# EAGLE design uo_C_SE_Main_Board (EAGLE 9.5.2)

## Sheet 1 of 3
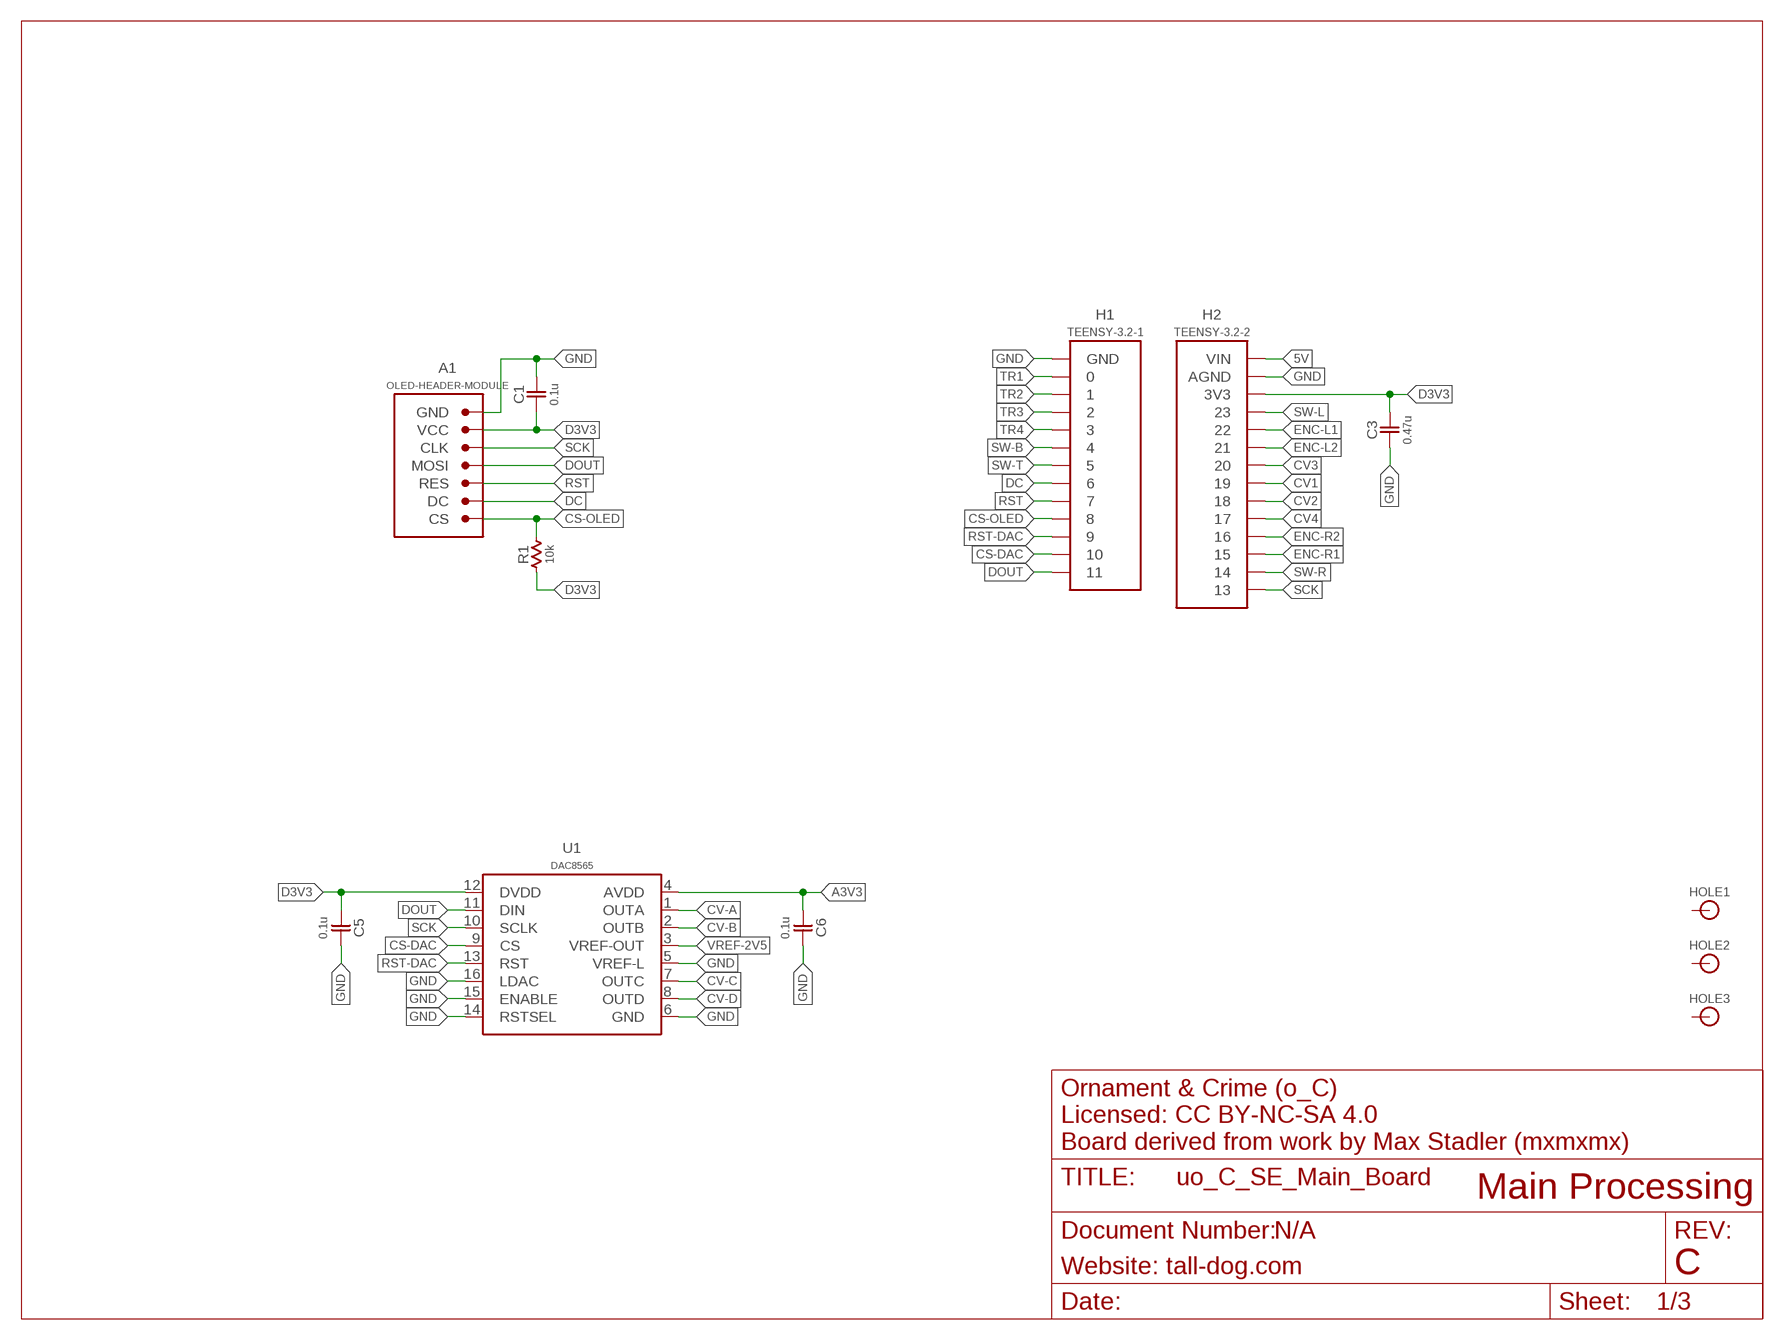
[diagram p0: schematic, sheet 1]

### Parts
A1  OLED-HEADER-MODULE  [DISPLAY-MODULE]
C1  0.1u  CAP-NP-0603  [0603-NP]
C3  0.47u  CAP-NP-0603  [0603-NP]
C5  0.1u  CAP-NP-0603  [0603-NP]
C6  0.1u  CAP-NP-0603  [0603-NP]
H1  TEENSY-3.2-1  [SMD-0.1-1X13]
H2  TEENSY-3.2-2  [SMD-0.1-1X14]
HOLE1  HOLE  [M2.5-HOLE]
HOLE2  HOLE  [M2.5-HOLE]
HOLE3  HOLE  [M2.5-HOLE]
R1  10k  RESISTOR-0603  [0603-NP]
U1  DAC8565  [TSSOP-16]

### Nets
5V: H2.1(VIN) ; also sheet 3
A3V3: C6.1 U1.4(AVDD) ; also sheet 2,3
CS-DAC: H1.12 U1.9(CS)
CS-OLED: A1.7(CS) H1.10 R1.2
CV1: H2.8 ; also sheet 2
CV2: H2.9 ; also sheet 2
CV3: H2.7 ; also sheet 2
CV4: H2.10 ; also sheet 2
CV-A: U1.1(OUTA) ; also sheet 2
CV-B: U1.2(OUTB) ; also sheet 2
CV-C: U1.7(OUTC) ; also sheet 2
CV-D: U1.8(OUTD) ; also sheet 2
D3V3: A1.2(VCC) C1.1 C3.2 C5.1 H2.3(3V3) R1.1 U1.12(DVDD)
DC: A1.6(DC) H1.8
DOUT: A1.4(MOSI) H1.13 U1.11(DIN)
ENC-L1: H2.5 ; also sheet 3
ENC-L2: H2.6 ; also sheet 3
ENC-R1: H2.12 ; also sheet 3
ENC-R2: H2.11 ; also sheet 3
GND: A1.1(GND) A1.G1(GND) A1.G2(GND) A1.G3(GND) A1.G4(GND) A1.G5(GND) A1.G6(GND) C1.2 C3.1 C5.2 C6.2 H1.1(GND) H2.2(AGND) U1.5(VREF-L) U1.6(GND) U1.14(RSTSEL) U1.15(ENABLE) U1.16(LDAC) ; also sheet 2,3
RST: A1.5(RES) H1.9
RST-DAC: H1.11 U1.13(RST)
SCK: A1.3(CLK) H2.14 U1.10(SCLK)
SW-B: H1.6 ; also sheet 3
SW-L: H2.4 ; also sheet 3
SW-R: H2.13 ; also sheet 3
SW-T: H1.7 ; also sheet 3
TR1: H1.2 ; also sheet 2
TR2: H1.3 ; also sheet 2
TR3: H1.4 ; also sheet 2
TR4: H1.5 ; also sheet 2
VREF-2V5: U1.3(VREF-OUT) ; also sheet 3
Unconnected: HOLE1.P$1 HOLE1.P$2 HOLE1.P$3 HOLE1.P$4 HOLE1.P$5 HOLE1.P$6 HOLE1.P$7 HOLE1.P$8 HOLE1.P$9 HOLE2.P$1 HOLE2.P$2 HOLE2.P$3 HOLE2.P$4 HOLE2.P$5 HOLE2.P$6 HOLE2.P$7 HOLE2.P$8 HOLE2.P$9 HOLE3.P$1 HOLE3.P$2 HOLE3.P$3 HOLE3.P$4 HOLE3.P$5 HOLE3.P$6 HOLE3.P$7 HOLE3.P$8 HOLE3.P$9

### Notes on the sheet
- Ornament & Crime (o_C)
  Licensed: CC BY-NC-SA 4.0
  Board derived from work by Max Stadler (mxmxmx)
- Main Processing
- N/A
- Website: tall-dog.com | C

## Sheet 2 of 3
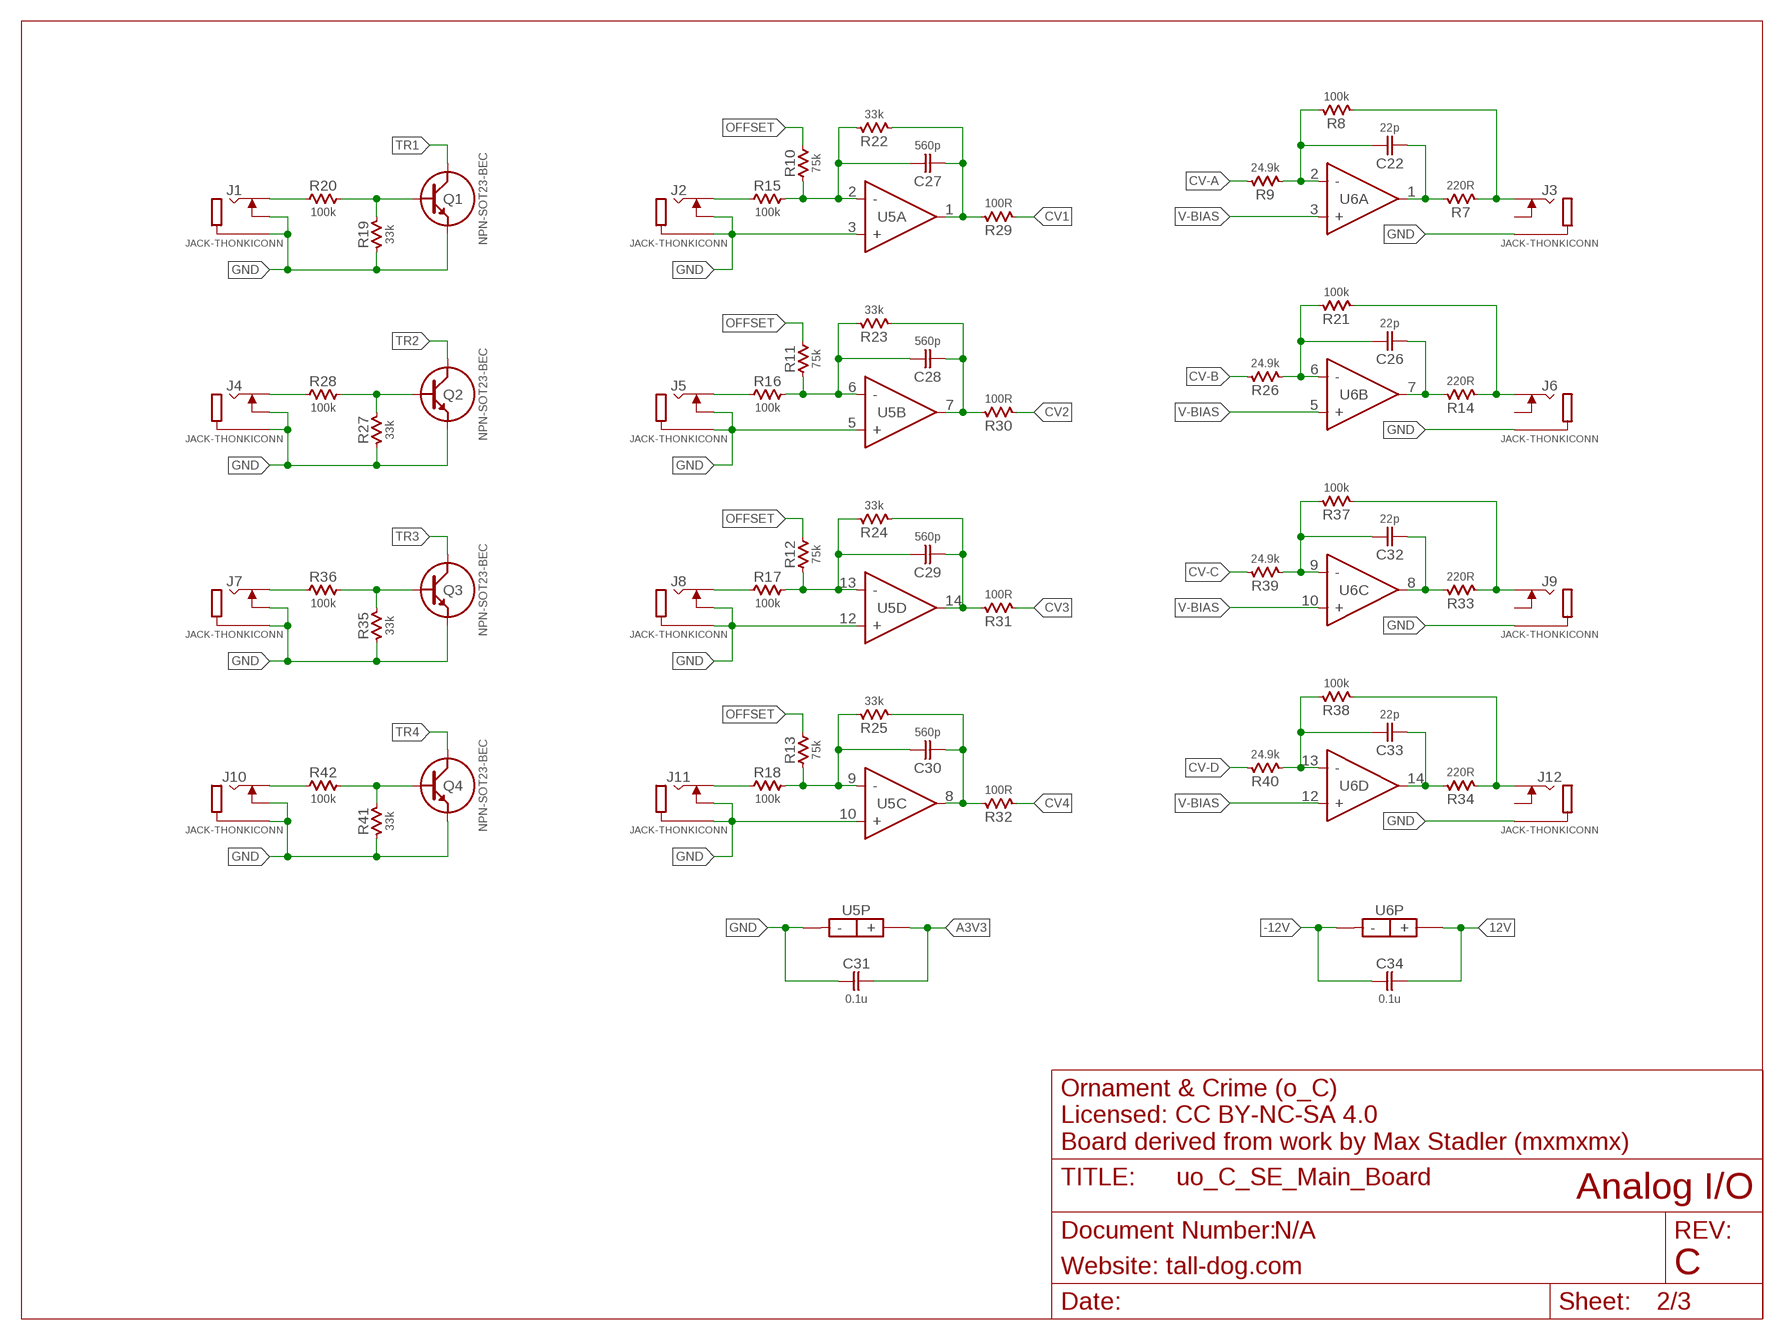
[diagram p1: schematic, sheet 2]

### Parts
C22  22p  CAP-NP-0603  [0603-NP]
C26  22p  CAP-NP-0603  [0603-NP]
C27  560p  CAP-NP-0603  [0603-NP]
C28  560p  CAP-NP-0603  [0603-NP]
C29  560p  CAP-NP-0603  [0603-NP]
C30  560p  CAP-NP-0603  [0603-NP]
C31  0.1u  CAP-NP-0603  [0603-NP]
C32  22p  CAP-NP-0603  [0603-NP]
C33  22p  CAP-NP-0603  [0603-NP]
C34  0.1u  CAP-NP-0603  [0603-NP]
J1  JACK-THONKICONN  [JACK]
J2  JACK-THONKICONN  [JACK]
J3  JACK-THONKICONN  [JACK]
J4  JACK-THONKICONN  [JACK]
J5  JACK-THONKICONN  [JACK]
J6  JACK-THONKICONN  [JACK]
J7  JACK-THONKICONN  [JACK]
J8  JACK-THONKICONN  [JACK]
J9  JACK-THONKICONN  [JACK]
J10  JACK-THONKICONN  [JACK]
J11  JACK-THONKICONN  [JACK]
J12  JACK-THONKICONN  [JACK]
Q1  NPN-SOT23-BEC  [SOT-23-3]
Q2  NPN-SOT23-BEC  [SOT-23-3]
Q3  NPN-SOT23-BEC  [SOT-23-3]
Q4  NPN-SOT23-BEC  [SOT-23-3]
R7  220R  RESISTOR-0603  [0603-NP]
R8  100k  RESISTOR-0603  [0603-NP]
R9  24.9k  RESISTOR-0603  [0603-NP]
R10  75k  RESISTOR-0603  [0603-NP]
R11  75k  RESISTOR-0603  [0603-NP]
R12  75k  RESISTOR-0603  [0603-NP]
R13  75k  RESISTOR-0603  [0603-NP]
R14  220R  RESISTOR-0603  [0603-NP]
R15  100k  RESISTOR-0603  [0603-NP]
R16  100k  RESISTOR-0603  [0603-NP]
R17  100k  RESISTOR-0603  [0603-NP]
R18  100k  RESISTOR-0603  [0603-NP]
R19  33k  RESISTOR-0603  [0603-NP]
R20  100k  RESISTOR-0603  [0603-NP]
R21  100k  RESISTOR-0603  [0603-NP]
R22  33k  RESISTOR-0603  [0603-NP]
R23  33k  RESISTOR-0603  [0603-NP]
R24  33k  RESISTOR-0603  [0603-NP]
R25  33k  RESISTOR-0603  [0603-NP]
R26  24.9k  RESISTOR-0603  [0603-NP]
R27  33k  RESISTOR-0603  [0603-NP]
R28  100k  RESISTOR-0603  [0603-NP]
R29  100R  RESISTOR-0603  [0603-NP]
R30  100R  RESISTOR-0603  [0603-NP]
R31  100R  RESISTOR-0603  [0603-NP]
R32  100R  RESISTOR-0603  [0603-NP]
R33  220R  RESISTOR-0603  [0603-NP]
R34  220R  RESISTOR-0603  [0603-NP]
R35  33k  RESISTOR-0603  [0603-NP]
R36  100k  RESISTOR-0603  [0603-NP]
R37  100k  RESISTOR-0603  [0603-NP]
R38  100k  RESISTOR-0603  [0603-NP]
R39  24.9k  RESISTOR-0603  [0603-NP]
R40  24.9k  RESISTOR-0603  [0603-NP]
R41  33k  RESISTOR-0603  [0603-NP]
R42  100k  RESISTOR-0603  [0603-NP]
U5  MCP6004-TSSOP-14  [TSSOP-14]
U6  OPA4172  [TSSOP-14]

### Nets
12V: C34.1 U6.4(P:+) ; also sheet 3
-12V: C34.2 U6.11(P:-) ; also sheet 3
A3V3: C31.1 U5.4(P:+) ; also sheet 1,3
CV1: R29.2 ; also sheet 1
CV2: R30.2 ; also sheet 1
CV3: R31.2 ; also sheet 1
CV4: R32.2 ; also sheet 1
CV-A: R9.1 ; also sheet 1
CV-B: R26.1 ; also sheet 1
CV-C: R39.1 ; also sheet 1
CV-D: R40.1 ; also sheet 1
GND: C31.2 J1.P1 J1.P2 J2.P1 J2.P2 J3.P1 J4.P1 J4.P2 J5.P1 J5.P2 J6.P1 J7.P1 J7.P2 J8.P1 J8.P2 J9.P1 J10.P1 J10.P2 J11.P1 J11.P2 J12.P1 Q1.2(E) Q2.2(E) Q3.2(E) Q4.2(E) R19.2 R27.2 R35.2 R41.2 U5.3(A:+) U5.5(B:+) U5.10(C:+) U5.11(P:-) U5.12(D:+) ; also sheet 1,3
N$8: J11.P3 R18.1
N$10: J8.P3 R17.1
N$11: J5.P3 R16.1
N$12: J2.P3 R15.1
N$13: J1.P3 R20.1
N$14: C27.1 R10.1 R15.2 R22.1 U5.2(A:-)
N$15: Q1.1(B) R19.1 R20.2
N$16: C28.1 R11.1 R16.2 R23.1 U5.6(B:-)
N$18: C29.1 R12.1 R17.2 R24.1 U5.13(D:-)
N$19: C22.2 R8.1 R9.2 U6.2(A:-)
N$20: C30.1 R13.1 R18.2 R25.1 U5.9(C:-)
N$21: J4.P3 R28.1
N$22: C27.2 R22.2 R29.1 U5.1(A:OUT)
N$23: C28.2 R23.2 R30.1 U5.7(B:OUT)
N$24: Q2.1(B) R27.1 R28.2
N$25: C29.2 R24.2 R31.1 U5.14(D:OUT)
N$26: C30.2 R25.2 R32.1 U5.8(C:OUT)
N$28: C26.2 R21.1 R26.2 U6.6(B:-)
N$30: J7.P3 R36.1
N$31: Q3.1(B) R35.1 R36.2
N$32: C32.2 R37.1 R39.2 U6.9(C:-)
N$34: C33.2 R38.1 R40.2 U6.13(D:-)
N$35: J10.P3 R42.1
N$36: Q4.1(B) R41.1 R42.2
N$37: C22.1 R7.1 U6.1(A:OUT)
N$38: C26.1 R14.1 U6.7(B:OUT)
N$39: C32.1 R33.1 U6.8(C:OUT)
N$40: C33.1 R34.1 U6.14(D:OUT)
N$45: J3.P3 R7.2 R8.2
N$46: J6.P3 R14.2 R21.2
N$47: J9.P3 R33.2 R37.2
N$48: J12.P3 R34.2 R38.2
OFFSET: R10.2 R11.2 R12.2 R13.2 ; also sheet 3
TR1: Q1.3(C) ; also sheet 1
TR2: Q2.3(C) ; also sheet 1
TR3: Q3.3(C) ; also sheet 1
TR4: Q4.3(C) ; also sheet 1
V-BIAS: U6.3(A:+) U6.5(B:+) U6.10(C:+) U6.12(D:+) ; also sheet 3
Unconnected: J3.P2 J6.P2 J9.P2 J12.P2

### Notes on the sheet
- Ornament & Crime (o_C)
  Licensed: CC BY-NC-SA 4.0
  Board derived from work by Max Stadler (mxmxmx)
- Analog I/O
- N/A
- Website: tall-dog.com | C

## Sheet 3 of 3
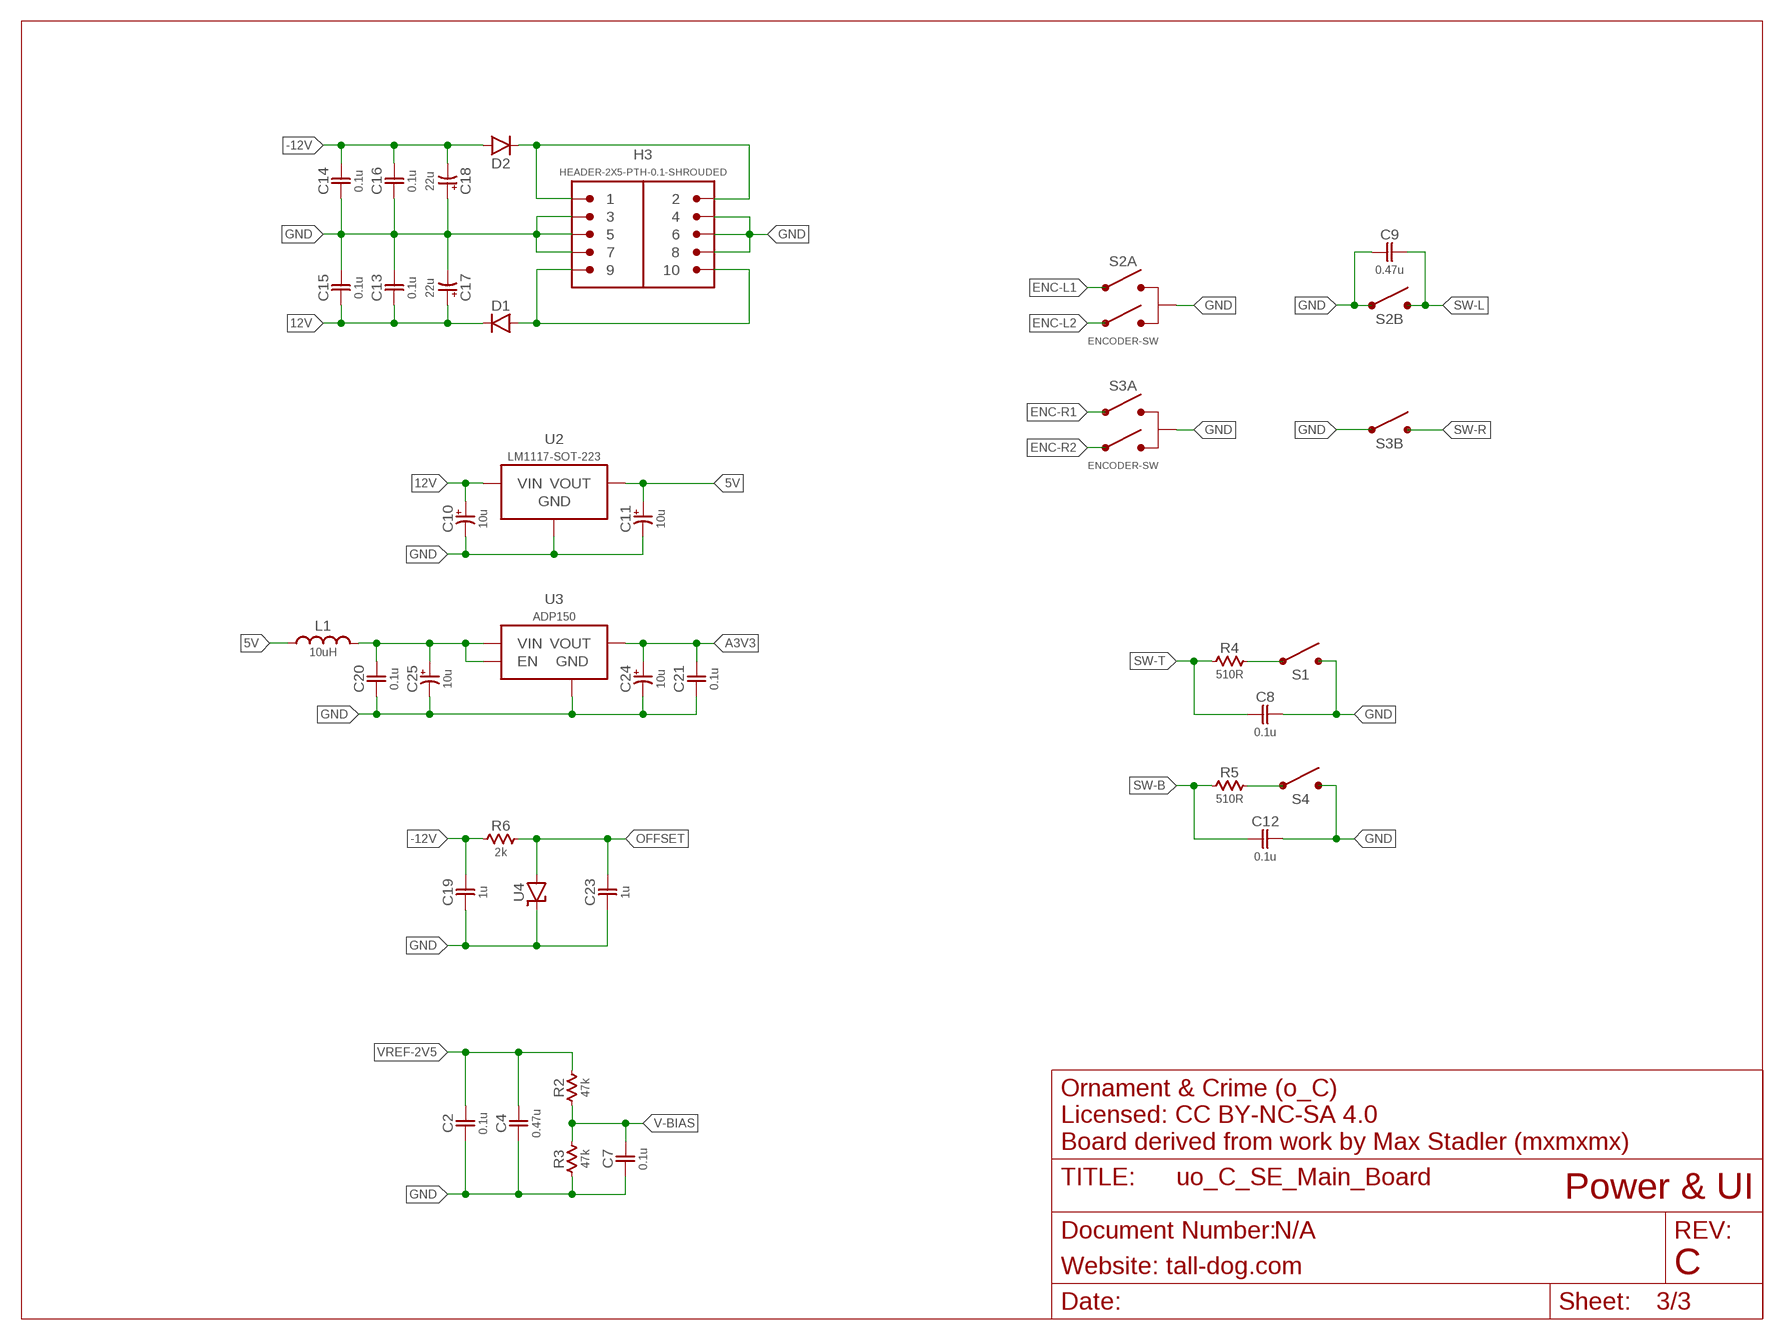
[diagram p2: schematic, sheet 3]

### Parts
C2  0.1u  CAP-NP-0603  [0603-NP]
C4  0.47u  CAP-NP-0603  [0603-NP]
C7  0.1u  CAP-NP-0603  [0603-NP]
C8  0.1u  CAP-NP-0603  [0603-NP]
C9  0.47u  CAP-NP-0603  [0603-NP]
C10  10u  CAP-P-4.3MM  [ELECTRO-SMD-4.3MM]
C11  10u  CAP-P-4.3MM  [ELECTRO-SMD-4.3MM]
C12  0.1u  CAP-NP-0603  [0603-NP]
C13  0.1u  CAP-NP-0603  [0603-NP]
C14  0.1u  CAP-NP-0603  [0603-NP]
C15  0.1u  CAP-NP-0603  [0603-NP]
C16  0.1u  CAP-NP-0603  [0603-NP]
C17  22u  CAP-P-6.6MM  [ELECTRO-SMD-6.6MM]
C18  22u  CAP-P-6.6MM  [ELECTRO-SMD-6.6MM]
C19  1u  CAP-NP-0603  [0603-NP]
C20  0.1u  CAP-NP-0603  [0603-NP]
C21  0.1u  CAP-NP-0603  [0603-NP]
C23  1u  CAP-NP-0603  [0603-NP]
C24  10u  CAP-P-4.3MM  [ELECTRO-SMD-4.3MM]
C25  10u  CAP-P-4.3MM  [ELECTRO-SMD-4.3MM]
D1  DIODE-SOD123  [SOD-123]
D2  DIODE-SOD123  [SOD-123]
H3  HEADER-2X5-PTH-0.1-SHROUDED  [PTH-0.1-2X5-SHROUDED]
L1  10uH  INDUCTOR-1210  [1210-NP]
R2  47k  RESISTOR-0603  [0603-NP]
R3  47k  RESISTOR-0603  [0603-NP]
R4  510R  RESISTOR-0603  [0603-NP]
R5  510R  RESISTOR-0603  [0603-NP]
R6  2k  RESISTOR-0603  [0603-NP]
S1  SPST-PTH  [TL1105]
S2  ENCODER-SW  [ENCODER-EC12E]
S3  ENCODER-SW  [ENCODER-EC12E]
S4  SPST-PTH  [TL1105]
U2  LM1117-SOT-223  [SOT-223]
U3  ADP150  [SOT-23-5]
U4  LM4040-SOT-23  [SOT-23-3]

### Nets
5V: C11.A(POS) L1.1 U2.2(VOUT) U2.4(VOUT) ; also sheet 1
12V: C10.A(POS) C13.1 C15.1 C17.A(POS) D1.C U2.3(VIN) ; also sheet 2
-12V: C14.2 C16.2 C18.C(NEG) C19.1 D2.A R6.1 ; also sheet 2
A3V3: C21.2 C24.A(POS) U3.5(VOUT) ; also sheet 1,2
ENC-L1: S2.B(A:B) ; also sheet 1
ENC-L2: S2.A(A:A) ; also sheet 1
ENC-R1: S3.B(A:B) ; also sheet 1
ENC-R2: S3.A(A:A) ; also sheet 1
GND: C2.2 C4.2 C7.2 C8.2 C9.1 C10.C(NEG) C11.C(NEG) C12.2 C13.2 C14.1 C15.2 C16.1 C17.C(NEG) C18.A(POS) C19.2 C20.1 C21.1 C23.2 C24.C(NEG) C25.C(NEG) H3.3 H3.4 H3.5 H3.6 H3.7 H3.8 R3.1 S1.3 S1.4 S2.C(A:C) S2.D S3.C(A:C) S3.D S4.3 S4.4 U2.1(GND) U3.2(GND) U4.1(C) ; also sheet 1,2
N$2: C20.2 C25.A(POS) L1.2 U3.1(VIN) U3.3(EN)
N$7: D2.C H3.1 H3.2
N$9: D1.A H3.9 H3.10
N$17: R4.2 S1.1 S1.2
N$27: R5.2 S4.1 S4.2
OFFSET: C23.1 R6.2 U4.2(A) ; also sheet 2
SW-B: C12.1 R5.1 ; also sheet 1
SW-L: C9.2 S2.E ; also sheet 1
SW-R: S3.E ; also sheet 1
SW-T: C8.1 R4.1 ; also sheet 1
V-BIAS: C7.1 R2.1 R3.2 ; also sheet 2
VREF-2V5: C2.1 C4.1 R2.2 ; also sheet 1

### Notes on the sheet
- Ornament & Crime (o_C)
  Licensed: CC BY-NC-SA 4.0
  Board derived from work by Max Stadler (mxmxmx)
- Power & UI
- N/A
- Website: tall-dog.com | C

## Library data of the parts
A1 = uo_C_SE_Library:OLED-HEADER; MANUFACTURERPARTNUMBER: TD-OCSE-B-DM
C1 C2 C5-C8 C12-C16 C20 C21 C31 C34 = uo_C_SE_Library:CAP-NP; MANUFACTURERPARTNUMBER: CL10B104JB8NNNC
C3 C4 C9 = uo_C_SE_Library:CAP-NP; MANUFACTURERPARTNUMBER: CL10B474KA8NFNC
C10 C11 C24 C25 = uo_C_SE_Library:CAP-P; MANUFACTURERPARTNUMBER: 865230440002
C17 C18 = uo_C_SE_Library:CAP-P; MANUFACTURERPARTNUMBER: 865230443003
C19 C23 = uo_C_SE_Library:CAP-NP; MANUFACTURERPARTNUMBER: CL10B105KA8NNNC
C22 C26 C32 C33 = uo_C_SE_Library:CAP-NP; MANUFACTURERPARTNUMBER: CL10C220FB8NNWC
C27-C30 = uo_C_SE_Library:CAP-NP; MANUFACTURERPARTNUMBER: CL10C561JB8NNNC
D1 D2 = uo_C_SE_Library:DIODE; MANUFACTURERPARTNUMBER: 1N5819HW-7-F
H1 = uo_C_SE_Library:TEENSY-3.2-1; MANUFACTURERPARTNUMBER: TSM-113-04-L-SV
H2 = uo_C_SE_Library:TEENSY-3.2-2; MANUFACTURERPARTNUMBER: TSM-114-04-L-SV
H3 = uo_C_SE_Library:HEADER-2X5; MANUFACTURERPARTNUMBER: 302-S101
HOLE1-HOLE3 = uo_C_SE_Library:HOLE; MANUFACTURERPARTNUMBER: DNP
J1-J12 = uo_C_SE_Library:JACK; MANUFACTURERPARTNUMBER: WQP-PJ398SM
L1 = uo_C_SE_Library:INDUCTOR; MANUFACTURERPARTNUMBER: NLCV32T-100K-PFR
Q1-Q4 = uo_C_SE_Library:NPN; MANUFACTURERPARTNUMBER: MMBT3904LT1G
R1 = uo_C_SE_Library:RESISTOR; MANUFACTURERPARTNUMBER: ERJ-3EKF1002V
R2 R3 = uo_C_SE_Library:RESISTOR; MANUFACTURERPARTNUMBER: ERJ-3EKF4702V
R4 R5 = uo_C_SE_Library:RESISTOR; MANUFACTURERPARTNUMBER: ERJ-3EKF5100V
R6 = uo_C_SE_Library:RESISTOR; MANUFACTURERPARTNUMBER: ERJ-3EKF2001V
R7 R14 R33 R34 = uo_C_SE_Library:RESISTOR; MANUFACTURERPARTNUMBER: ERJ-3EKF2200V
R8 R15-R18 R20 R21 R28 R36-R38 R42 = uo_C_SE_Library:RESISTOR; MANUFACTURERPARTNUMBER: ERA-3AEB104V
R9 R26 R39 R40 = uo_C_SE_Library:RESISTOR; MANUFACTURERPARTNUMBER: ERA-3AEB2492V
R10-R13 = uo_C_SE_Library:RESISTOR; MANUFACTURERPARTNUMBER: ERJ-3EKF7502V
R19 R22-R25 R27 R35 R41 = uo_C_SE_Library:RESISTOR; MANUFACTURERPARTNUMBER: ERJ-3EKF3302V
R29-R32 = uo_C_SE_Library:RESISTOR; MANUFACTURERPARTNUMBER: ERJ-3EKF1000V
S1 S4 = uo_C_SE_Library:SPST; MANUFACTURERPARTNUMBER: TL1105DF160Q
S2 S3 = uo_C_SE_Library:ENCODER-SW: ALPS rotary Encoder EC12E series with switch; MANUFACTURERPARTNUMBER: ED1212S-24P-24C-25KC
U1 = uo_C_SE_Library:DAC8565; MANUFACTURERPARTNUMBER: DAC8565IAPW
U2 = uo_C_SE_Library:LM1117: 800mA and 1A Low Dropout (LDO) Positive Regulator 1.8V, 2.5V, 2.85V, 3.3V, 5V, and Adj; MANUFACTURERPARTNUMBER: LM1117MPX-5.0/NOPB
U3 = uo_C_SE_Library:ADP150; MANUFACTURERPARTNUMBER: ADP150AUJZ-3.3-R7
U4 = uo_C_SE_Library:LM4040: PRECISION MICROPOWER SHUNT VOLTAGE REFERENCE Source: http://focus.ti.com/lit/ds/slcs146e/slcs146e.pdf; MANUFACTURERPARTNUMBER: LM4040DIM3-5.0/NOPB
U5 = uo_C_SE_Library:MCP6004; MANUFACTURERPARTNUMBER: MCP6004T-I/ST
U6 = uo_C_SE_Library:OPA4172; MANUFACTURERPARTNUMBER: OPA4172IPW

## Board
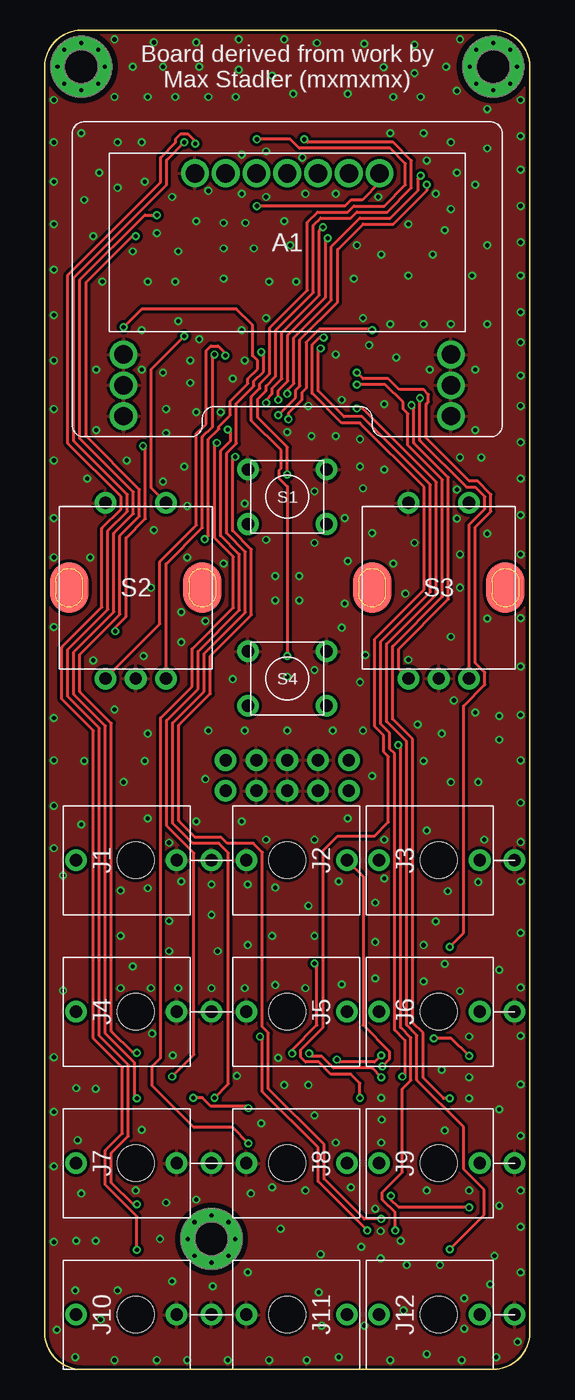
[diagram p3: board, top side]
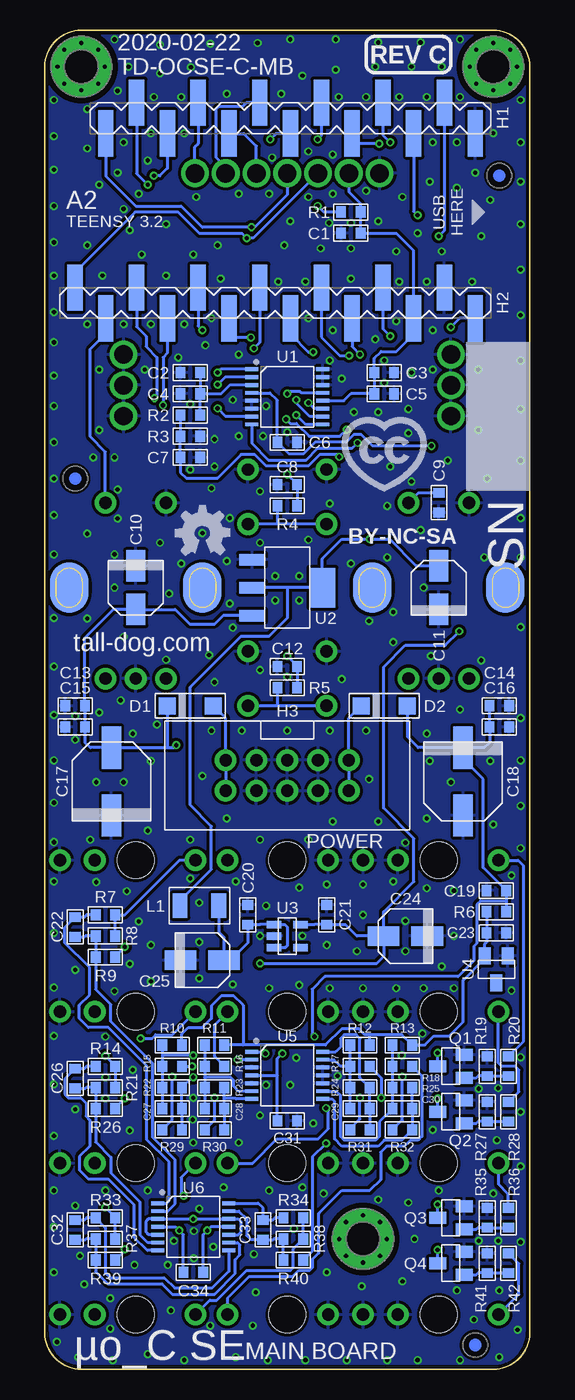
[diagram p4: board, bottom side, seen from below]

Size 40 x 110.5 mm. Coordinates in mm from the lower left corner, seen from the top.
Outline: 3,0 37,0 arc90 40,3 40,107.5 arc90 37,110.5 3,110.5 arc90 0,107.5 0,3 arc90 3,0
Copper layers (1*16): Top 0.035mm / dielectric 1.5mm / Bottom 0.035mm
Design rules "default *": minimum track width 0.25mm, minimum drill 0.25mm, track to track 6mil, track to pad 6mil, pad to pad 6mil, via to via 6mil, smd to smd 0mil, copper to edge 10.5mil, drill to drill 8mil, minimum pad ring 6mil, minimum via ring 6mil, stop-mask expansion 0mil, vias tented up to drill 0.35mm, thermal gap 10mil

### Footprints (pad centres in the part's own frame; a part is rotated, then mirrored left to right if it is on the bottom)
DISPLAY-MODULE = drill 1.524 pad 2.286: 1 -7.62,5.7; 2 -5.08,5.7; 3 -2.54,5.7; 4 0,5.7; 5 2.54,5.7; 6 5.08,5.7; 7 7.62,5.7; G1 -13.5,-9.26; G2 -13.5,-11.8; G3 -13.5,-14.34; G4 13.5,-14.34; G5 13.5,-11.8; G6 13.5,-9.26
0603-NP = smd 0.81 x 0.93: 1 -0.81,0; 2 0.81,0
ELECTRO-SMD-4.3MM = smd 2.6 x 1.6: A 1.8,0; C -1.8,0
ELECTRO-SMD-6.6MM = smd 3.5 x 1.6: A 2.8,0; C -2.8,0
SOD-123 = smd 1.4 x 1.4: A 1.9,0; C -1.9,0
SMD-0.1-1X13 = smd 1.27 x 3.81: 1 -16.51,1.27; 2 -13.97,-1.27; 3 -11.43,1.27; 4 -8.89,-1.27; 5 -6.35,1.27; 6 -3.81,-1.27; 7 -1.27,1.27; 8 1.27,-1.27; 9 3.81,1.27; 10 6.35,-1.27; 11 8.89,1.27; 12 11.43,-1.27; 13 13.97,1.27
SMD-0.1-1X14 = smd 1.27 x 3.81: 1 -16.51,1.27; 2 -13.97,-1.27; 3 -11.43,1.27; 4 -8.89,-1.27; 5 -6.35,1.27; 6 -3.81,-1.27; 7 -1.27,1.27; 8 1.27,-1.27; 9 3.81,1.27; 10 6.35,-1.27; 11 8.89,1.27; 12 11.43,-1.27; 13 13.97,1.27; 14 16.51,-1.27
PTH-0.1-2X5-SHROUDED = drill 1.016 pad 1.778: 1 -1.27,5.08; 2 1.27,5.08; 3 -1.27,2.54; 4 1.27,2.54; 5 -1.27,0; 6 1.27,0; 7 -1.27,-2.54; 8 1.27,-2.54; 9 -1.27,-5.08; 10 1.27,-5.08
M2.5-HOLE = drill 2.75 pad 5: P$1 0,0 | drill 0.35: P$2 0,1.95; P$3 0,-1.95; P$4 -1.95,0; P$5 1.95,0; P$6 1.4,1.4; P$7 -1.4,1.4; P$8 -1.4,-1.4; P$9 1.4,-1.4
JACK = drill 1.016 pad 1.778: P1 0,-6.25; P2 0,-3.38; P3 0,4.92 | hole 3: 0,0
1210-NP = smd 1.2 x 2: 1 -1.6,0; 2 1.6,0
SOT-23-3 = smd 1 x 1.4: 1 -0.95,-1.1; 2 0.95,-1.1; 3 0,1.1
TL1105 = drill 1.016 pad 1.778: 1 -3.25,-2.25; 2 3.25,-2.25; 3 -3.25,2.25; 4 3.25,2.25
ENCODER-EC12E = drill 1.016 pad 1.778: A -2.5,-7.5; B 2.5,-7.5; C 0,-7.5; D -2.5,7; E 2.5,7 | smd 3.2 x 4.2 bottom: G1B -5.5,0; G1B1 5.5,0 | smd 3.2 x 4.2: G1T -5.5,0; G1T1 5.5,0
TSSOP-16 = smd 0.32 x 1.05: 1 -2.275,-2.925; 2 -1.625,-2.925; 3 -0.975,-2.925; 4 -0.325,-2.925; 5 0.325,-2.925; 6 0.975,-2.925; 7 1.625,-2.925; 8 2.275,-2.925; 9 2.275,2.925; 10 1.625,2.925; 11 0.975,2.925; 12 0.325,2.925; 13 -0.325,2.925; 14 -0.975,2.925; 15 -1.625,2.925; 16 -2.275,2.925
SOT-223 = smd 0.95 x 2.15: 1 -2.3,-2.9; 2 0,-2.9; 3 2.3,-2.9 | smd 3.25 x 2.15: 4 0,2.9
SOT-23-5 = smd 0.62 x 1.22: 1 -0.95,-1.1; 2 0,-1.1; 3 0.95,-1.1; 4 0.95,1.1; 5 -0.95,1.1
TSSOP-14 = smd 0.32 x 1.05: 1 -1.95,-2.925; 2 -1.3,-2.925; 3 -0.65,-2.925; 4 0,-2.925; 5 0.65,-2.925; 6 1.3,-2.925; 7 1.95,-2.925; 8 1.95,2.925; 9 1.3,2.925; 10 0.65,2.925; 11 0,2.925; 12 -0.65,2.925; 13 -1.3,2.925; 14 -1.95,2.925

### Placement (x,y rotation side)
A1  20,93 0 top
C1  14.75,93.75 180 bottom
C2  28,82.25 180 bottom
C3  12,82.25 180 bottom
C4  28,80.5 180 bottom
C5  12,80.5 0 bottom
C6  20,76.5 0 bottom
C7  28,75.25 0 bottom
C8  20,73 180 bottom
C9  7.49,71.51 90 bottom
C10  32.5,64.5 270 bottom
C11  7.5,64.5 90 bottom
C12  20,58 180 bottom
C13  37.5,54.75 180 bottom
C14  2.5,54.75 180 bottom
C15  37.5,53 180 bottom
C16  2.5,53 180 bottom
C17  34.5,48.5 90 bottom
C18  5.5,48.5 270 bottom
C19  2.75,39.5 180 bottom
C20  23.25,37.5 270 bottom
C21  16.75,37.5 270 bottom
C22  37.5,36.5 270 bottom
C23  2.75,36 0 bottom
C24  10.25,35.75 180 bottom
C25  27,33.75 0 bottom
C26  37.5,24 270 bottom
C27  29.5,21.5 0 bottom
C28  26,21.5 0 bottom
C29  14,21.5 0 bottom
C30  10.5,21.5 0 bottom
C31  20,20.5 0 bottom
C32  37.5,11.5 270 bottom
C33  22,11.5 270 bottom
C34  27.75,8 0 bottom
D1  28,54.75 0 bottom
D2  12,54.75 0 bottom
H1  21,103.25 180 bottom
H2  21,88 180 bottom
H3  20,49 270 bottom
HOLE1  3,107.5 0 top
HOLE2  37,107.5 0 top
HOLE3  13.75,10.75 0 top
J1  7.5,42 90 top
J2  20,42 270 top
J3  32.5,42 90 top
J4  7.5,29.5 90 top
J5  20,29.5 270 top
J6  32.5,29.5 90 top
J7  7.5,17 90 top
J8  20,17 270 top
J9  32.5,17 90 top
J10  7.5,4.5 90 top
J11  20,4.5 270 top
J12  32.5,4.5 90 top
L1  27.25,38.25 0 bottom
Q1  6.5,25 90 bottom
Q2  6.5,21.25 90 bottom
Q3  6.5,12.5 90 bottom
Q4  6.5,8.75 90 bottom
R1  14.75,95.5 180 bottom
R2  28,78.75 0 bottom
R3  28,77 180 bottom
R4  20,71.25 180 bottom
R5  20,56.25 180 bottom
R6  2.75,37.75 180 bottom
R7  35,37.5 0 bottom
R8  35,35.75 0 bottom
R9  35,34 180 bottom
R10  29.5,26.75 0 bottom
R11  26,26.75 0 bottom
R12  14,26.75 0 bottom
R13  10.5,26.75 0 bottom
R14  35,25 0 bottom
R15  29.5,25 180 bottom
R16  26,25 180 bottom
R17  14,25 180 bottom
R18  10.5,25 180 bottom
R19  3.5,25 90 bottom
R20  1.75,25 270 bottom
R21  35,23.25 0 bottom
R22  29.5,23.25 0 bottom
R23  26,23.25 0 bottom
R24  14,23.25 0 bottom
R25  10.5,23.25 0 bottom
R26  35,21.5 180 bottom
R27  3.5,21.25 90 bottom
R28  1.75,21.25 270 bottom
R29  29.5,19.75 180 bottom
R30  26,19.75 180 bottom
R31  14,19.75 180 bottom
R32  10.5,19.75 180 bottom
R33  35,12.5 0 bottom
R34  19.5,12.5 0 bottom
R35  3.5,12.5 90 bottom
R36  1.75,12.5 270 bottom
R37  35,10.75 0 bottom
R38  19.5,10.75 0 bottom
R39  35,9 180 bottom
R40  19.5,9 180 bottom
R41  3.5,8.75 90 bottom
R42  1.75,8.75 270 bottom
S1  20,72 0 top
S2  7.5,64.5 0 top
S3  32.5,64.5 0 top
S4  20,57 0 top
U1  20,80.25 270 bottom
U2  20,64.5 270 bottom
U3  20,35.75 270 bottom
U4  2.75,33 180 bottom
U5  20,24.25 270 bottom
U6  27.75,11.75 270 bottom
U$1  [LOGO-CC]  12,75.5 0 bottom
U$2  [LOGO-OSH]  27,69 0 bottom
U$3  [LOGO-REV]  10,108.5 0 bottom
U$4  [FIDUCIAL]  37.5,73.5 0 bottom
U$5  [FIDUCIAL]  2.5,98.5 0 bottom
U$6  [FIDUCIAL]  4.5,2 0 bottom

### Tracks (layer width: path | path; a pad name or v marks a point on that pad's centre or on a via)
5V  (via drill 0.35)
  Top 0.25: v13.2,68.5 13.5,68.8 13.5,76.75 14.35,77.6 14.35,77.8 15.3,78.75 15.3,79.9 16.75,81.35 16.75,81.75 17.55,82.55 17.55,83.25 17.15,83.65 17.15,86.15 15.8,87.5 8,87.5 v6.5,86
  Bottom 0.25: 20,64.5 U2.4 17.1,66.9 15.5,68.5 v13.2,68.5 11.55,68.5 9.35,66.3 C11.A | 20,64.5 U2.2 | H2.1 5.77,86.73 v6.5,86 | L1.1 28.85,38.65 26.25,41.25 26.25,44.8 28,46.55 28,56.3 23.8,60.5 21.5,60.5 20,62 20,64.5
12V  (via drill 0.35)
  Top 0.25: v28.9,11.45 28.9,12.95 27.85,14 27.85,14.6 29.5,16.25 29.5,23.15 30.2,23.85 30.2,27.35 29.35,28.2 29.35,51.3 v29.15,51.5
  Bottom 0.25: U6.4 29.2,11.75 v28.9,11.45 28.56,11.11 C34.1 | 29.9,51.3 C17.A 36.25,51.3 36.69,51.74 C15.1 C13.1 36.69,60.36 34.35,62.7 C10.A 29.25,62.7 28.05,61.5 26,61.5 25.3,62.2 U2.3 | D1.C 29.9,51.3 | 29.9,51.3 29.35,51.3 v29.15,51.5
-12V  (via drill 0.35)
  Top 0.25: v26.6,11.45 22.55,15.5 22.55,18.3 17.95,22.9 17.95,27.25 v17.75,27.45
  Bottom 0.25: U6.11 26.3,11.75 v26.6,11.45 26.94,11.11 C34.2 | 1.94,38.65 C19.1 3.85,41.41 3.85,48.7 5.5,50.35 C18.C | 1.94,38.65 R6.1 | C14.2 C16.2 3.31,51.74 3.75,51.3 C18.C | C18.C 9.2,51.3 10.1,52.2 D2.A | 1.94,38.65 4.05,38.65 4.35,38.35 4.35,35.15 4.6,34.9 4.6,33.7 5.9,32.4 16.9,32.4 17.95,31.35 17.95,27.65 v17.75,27.45
A3V3  (via drill 0.35)
  Top 0.25: v20.4,26.05 20.4,26.35 22.45,28.4 22.45,33.3 v22.25,33.5 | v5.8,60.9 5.8,61.2 6.7,62.1 6.7,68.6 8.3,70.2 8.3,76 v8.1,76.2
  Bottom 0.25: U5.4 20.81,24.25 | v20.4,26.05 20.81,25.64 20.81,24.25 | C31.1 20.81,24.25 | v5.8,60.9 6.95,59.75 10.25,59.75 12.05,57.95 12.05,46.3 9.55,43.8 9.55,40.25 12.05,37.75 C24.A | U1.4 21.43,80.58 20.81,79.96 C6.1 19.86,75.55 18.65,75.55 17.7,76.5 15.15,76.5 14.5,77.15 13.9,77.15 12.95,76.2 v8.1,76.2 | U3.5 17.75,36.7 17.74,36.69 C21.2 15.2,36.69 15.2,36.7 14.25,35.75 C24.A | v22.25,33.5 12.6,33.5 12.05,34.05 C24.A
CS-DAC  (via drill 0.35)
  Top 0.25: v19.25,78.75 20.7,80.2 20.7,80.8 21.05,81.15 21.05,84.95 24.15,88.05 24.15,92.4 26.25,94.5 28.75,94.5 31.5,97.25 v31.5,97.75
  Bottom 0.25: H1.12 32.43,98.68 v31.5,97.75 | U1.9 18.48,77.97 v19.25,78.75
CS-OLED  (via drill 0.35)
  Top 0.25: A1.7 27.62,97.95 26.17,96.5 25.25,96.5 24.75,96 v17.5,96
  Bottom 0.25: A1.7 27.62,100.88 27.35,101.15 H1.10 | v17.5,96 17,95.5 R1.2
CV1  (via drill 0.35)
  Top 0.25: v29.5,24.15 29.7,24.35 29.7,27.15 28.85,28 28.85,50.8 28.45,51.2 28.45,52.5 27.7,53.25 27.7,60.05 31.8,64.15 31.8,73 26.2,78.6 24.7,78.6 22.55,80.75 22.55,84.05 v22.75,84.25
  Bottom 0.25: R29.2 29.5,20.56 v29.5,24.15 | H2.8 22.27,84.73 v22.75,84.25
CV2  (via drill 0.35)
  Top 0.25: v26,22.4 26,23.6 25.25,24.35 23.6,24.35 22.6,25.35 21.5,25.35 21.1,25.75 21.1,26.35 22.95,28.2 22.95,42.8 24.15,44 27.2,44 28.35,45.15 28.35,50.55 27.95,50.95 27.95,52.3 27.2,53.05 27.2,60.25 31.3,64.35 31.3,72.8 26,78.1 24.5,78.1 22.05,80.55 22.05,84.55 22.65,85.15 v23,85.15
  Bottom 0.25: R30.2 26,20.56 v26,22.4 | H2.9 24.81,85.15 v23,85.15
CV3  (via drill 0.35)
  Top 0.25: v14,22.4 15.15,23.55 15.15,42.6 14.35,43.4 12.2,43.4 10.55,45.05 10.55,53.35 13.15,55.95 13.15,59.05 16.55,62.45 16.55,67.45 15,69 15,75.6 15.8,76.4 15.8,79.7 17.25,81.15 17.25,81.55 18.05,82.35 18.05,83.75 v17.85,83.95
  Bottom 0.25: R31.2 14.81,19.84 14,20.65 v14,22.4 | H2.7 19.73,85.43 18.25,83.95 v17.85,83.95
CV4  (via drill 0.35)
  Top 0.25: v10.5,24.15 12.3,25.95 12.3,42.6 10.05,44.85 10.05,53.55 12.65,56.15 12.65,59.25 16.05,62.65 16.05,67.25 14.5,68.8 14.5,75.8 15.3,76.6 15.3,77.35 v15.1,77.55 | v27,85.75 26.9,85.85 22.65,85.85 21.55,84.75 21.55,80.95 21.2,80.6 21.2,80 20.1,78.9 v20.1,78.4
  Bottom 0.25: R32.2 10.5,20.56 v10.5,24.15 | H2.10 27.35,86.1 v27,85.75 | v20.1,78.4 19.75,78.05 19.25,78.05 18.2,77 15.65,77 v15.1,77.55
CV-A  (via drill 0.35)
  Top 0.25: v33.4,34.85 34.55,36 34.55,54.75 36.3,56.5 36.3,57.5 35.5,58.3 35.5,69.5 36.8,70.8 36.8,72.2 35.7,73.3 35,73.3 31.45,76.85 31.45,79.65 31.65,79.85 31.65,80.45 31.25,80.85 29.25,80.85 28.35,81.75 26.25,81.75 v25.75,82.25
  Bottom 0.25: R9.1 34.19,34.06 v33.4,34.85 | U1.1 25.48,82.53 v25.75,82.25
CV-B  (via drill 0.35)
  Top 0.25: v33.4,22.35 32.9,22.35 31.2,24.05 31.2,27.75 30.35,28.6 30.35,52 28.7,53.65 28.7,59.65 32.8,63.75 32.8,73.4 29.95,76.25 29.95,78.85 29.55,79.25 29.55,79.8 28.1,81.25 v25.75,81.25
  Bottom 0.25: R26.1 34.19,21.56 v33.4,22.35 | U1.2 25.12,81.88 v25.75,81.25
CV-C  (via drill 0.35)
  Top 0.25: v33.4,9.9 36.25,12.75 36.25,14.8 34.55,16.5 34.55,20 30.7,23.85 30.7,27.55 29.85,28.4 29.85,51.8 28.2,53.45 28.2,59.85 32.3,63.95 32.3,73.2 26.2,79.3 v25.75,79.3
  Bottom 0.25: R39.1 33.4,9.79 v33.4,9.9 | U1.7 25.07,78.62 v25.75,79.3
CV-D  (via drill 0.35)
  Top 0.25: v16.8,18.65 15.5,19.95 12.3,19.95 8.85,23.4 8.85,25 9.55,25.7 9.55,53.75 12.15,56.35 12.15,59.45 15.55,62.85 15.55,67.05 14,68.6 14,76.25 v14.2,76.45
  Bottom 0.25: R40.1 17.9,9.79 17.9,17.55 v16.8,18.65 | U1.8 22.93,76.42 21.55,75.05 18.45,75.05 17.5,76 14.65,76 v14.2,76.45
D3V3
  Bottom 0.25: U1.12 15.32,79.92 14.75,80.5 C5.1 C3.2 12.81,83.44 12.25,84 11,84 9.57,85.43 H2.3 9.57,92.32 11,93.75 C1.1 R1.1 13.94,96.19 14.92,97.17 A1.2
DC
  Bottom 0.25: A1.6 25.08,99.2 25.85,99.97 25.85,104 25.6,104.25 23.65,104.25 23.38,104.52 H1.8
DOUT  (via drill 0.35)
  Top 0.25: v18.25,79.75 18.25,80 18.75,80.5 18.75,80.95 19.55,81.75 19.55,85.55 22.65,88.65 22.65,93.95 v22.95,94.25
  Bottom 0.25: A1.4 20,96.95 22.7,94.25 v22.95,94.25 27,94.25 28.75,96 32.5,96 34.97,98.47 H1.13 | U1.11 17.77,79.28 v18.25,79.75
ENC-L1  (via drill 0.35)
  Top 0.25: S2.B 10,66.45 13,69.45 13,76.95 13.8,77.75 13.8,83.55 v14,83.75
  Bottom 0.25: H2.5 14.65,84.4 v14,83.75
ENC-L2  (via drill 0.35)
  Top 0.25: S2.A 9.5,61.5 9.5,66.65 12.5,69.65 12.5,77.2 13.3,78 13.3,84.05 13.7,84.45 14.3,84.45 14.9,83.85 v14.9,83.65
  Bottom 0.25: H2.6 17.19,85.19 15.65,83.65 v14.9,83.65
ENC-R1  (via drill 0.35)
  Top 0.25: S3.B 35,69.7 36.3,71 36.3,72 35.5,72.8 34.8,72.8 30.95,76.65 v30.95,80.15
  Bottom 0.25: H2.12 32.43,86.03 31.65,85.25 31.65,84.4 30.75,83.5 30.75,80.35 v30.95,80.15
ENC-R2  (via drill 0.35)
  Top 0.25: S3.A 29.2,57.8 29.2,59.45 33.3,63.55 33.3,73.6 30.45,76.45 30.45,79.35 v30.25,79.55
  Bottom 0.25: H2.11 29.89,83.86 30.25,83.5 v30.25,79.55
GND  (via drill 0.35)
  other vias: 17.85,20.3 5.75,109.75 9,109.5 12.5,109.5 16,109.75 19.75,109.75 22.45,109.45 26.35,109.4 30.5,109.3 34.25,109.75 39.25,70.5 39.25,67.25 39.25,62 39.25,58 39.25,54 39.25,50.25 39.25,46.75 39.25,43.5 39.25,40.25 39.25,36 39.25,31.5 39.25,27.5 39.25,23.5 39.25,19.25 39.25,14.75 39.25,11.75 39.25,8 39,2.25 37.25,1 34.4,0.75 31.5,1.25 28.5,0.75 24.25,1 21.6,0.75 18.5,0.75 15.1,0.75 11.75,0.75 9.25,0.75 5.75,0.75 2.5,1 1,3.25 0.75,10.5 0.75,16.75 0.75,21.25 0.75,25.75 1.5,31.25 1.5,40.75 0.75,43 0.75,46.5 0.75,50.25 0.75,53.75 0.75,61.25 0.75,67 0.75,70.25 3.75,67 11.75,71.25 9,69.25 11.75,67 14.75,66.5 11.25,62.5 11.25,60 13.25,61.75 8.15,58.85 4,58.5 5.75,54.45 8.5,52.45 8.25,50.2 6.5,48.45 8.5,45.45 10.25,43.45 3.25,50.2 3,44.95 12.5,45.2 13.25,48.7 13.5,52.7 16.25,45.2 18.25,43.7 22.25,43.7 25,45.45 27,48.95 26.25,52.7 23.75,52.7 16.5,52.7 15.5,56.95 19,63.45 21,63.45 22.25,57.7 26,56.7 24.5,61.2 19,65.45 21,65.45 18.25,68.45 22.25,68.2 25,66.7 16.5,71.45 22.25,72.45 26.25,72.7 27,69 30.5,68.2 24.75,63.2 36.5,68.95 34,70.2 36.5,61.95 33.5,60.45 30,58.55 33.75,55.2 30.75,53.2 32.75,52.45 35.5,54.2 37.5,51.95 35.75,48.45 33.5,48.45 31.25,50.2 31.5,44.45 36.25,43.7 28,43.7 20,52.7 8.5,39.7 6.25,31.45 8.75,31.45 11,31.45 13.75,31.45 16.5,31.45 21.5,31.45 19,31.7 35.75,40.2 33.25,39.45 32.25,36.95 33,33.45 34.25,31.2 37.5,32.95 35,27.45 32.75,24.7 33,19.7 37.5,21.45 19.25,25.7 19.75,23.45 21.75,23.45 22.25,20.95 24,18.7 27.75,18.7 35,22.35 27.75,22.4 27.8,20.6 35,24.1 25.25,15 27.25,13.25 21.5,14.75 18.75,15 17,14.5 7.5,14.75 8,19.75 2.6,23.2 4.2,23.15 2.7,18.9 8.85,27.7 10.55,25.9 15.85,24.2 12.5,14 10,13.75 9.5,10.75 10.5,7.25 16.75,8 3,14.5 4.2,10.6 6,6.5 2.5,6.5 2.6,10.6 4.6,4.1 13.85,6.85 22.6,6.35 22.85,3.6 26.35,3.6 29.6,4.85 34.6,3.35 34.6,5.85 37.1,9.35 32.6,8.6 29.85,8.6 29.35,10.6 26.1,10.1 27.7,11.4 27.7,9.15 19.45,11.6 22.75,9.5 31.5,14.75 35,14.75 37.5,13.5 36.75,7 8.75,64.5 29.75,64 34.25,64.5 7.25,33.25 10.25,34.5 10.25,37 6.25,35.75 6.25,39.5 13.75,37.5 14.25,34.5 16.75,35 18.75,35.75 22.25,35.75 21.75,38.25 19,39.75 24.5,31.75 27.25,32.25 27.25,35.25 27.25,38.5 24.25,40.25 28,40.5 31.25,35 31.25,32 16.75,40 13.75,40 11.25,40.25 20,77.35 0.75,104.75 0.75,101.25 0.75,98 0.75,94.5 0.75,90.75 0.75,87 0.75,83.25 0.75,79.25 0.75,75 3.5,73.5 6.75,75 4.25,77.5 4.25,82.5 4.75,89.75 4.5,98.75 6,101.25 8,101.25 8.5,105 5.75,105 13.5,105 15.75,105 8.25,98 6,97.5 4,93.5 9.25,93.75 11,92.25 8.5,89.75 7.25,92.25 10.75,89.75 14.75,90 17.25,92.5 20.25,92.75 20.75,89.75 10.75,105 20.5,105.25 25,105.25 28.75,105 31,105 27.95,107.45 18.75,106.75 16,107.25 12.75,107.5 7.25,107.5 3,102 3.25,96.5 14.75,92.5 31.25,102 30.5,106.95 34,105.5 36.5,104 39.25,104.75 39.25,101.75 39.25,99 39.25,96 39.25,93 39.25,90.25 39.25,87.25 39.25,84.75 39.25,82 39.25,79.5 39.25,76.5 39.25,73.5 33.5,101.25 36.5,100.75 33.5,95.75 35.5,97.75 36.5,92.75 35.25,90.25 36.5,86.25 33.5,86.25 31.25,86.25 30,90.25 33,94 25.5,90 32,92 27.75,92 28.5,86.25 29,83.5 24,83.75 26.25,86.75 18.25,86.75 16.25,85.75 18.5,89.75 26.75,84.5 21.75,79.5 22,77 24,77 28,74.25 26,74.5 26,76.75 24.5,80 28,79.65 31.75,82.5 34.25,75.25 35.5,77.5 35.5,82.5 36,75.25 34,72.6 28.75,66.5 34.25,67.25 24.75,70.25 8,85.75 11,86.5 12.75,85 16.5,83.25 15.5,81.75 14.5,79 12,81.4 12,83.25 9.75,82.25 10,79.25 12.5,79 10,77.25 11.5,74.5 9.75,73.25 8,82.5 14.75,94.6 16.55,94.6 37.5,53.9 20,57.15 9.75,107.5 33.1,107.5 26.45,58.95 13.5,97.25 16.25,97 21.5,97 24,97 21.25,100 18.25,100.5 16.25,100.25 10.5,96.75 12.5,94.75 19.75,94.75 18.25,96.75 27.5,96.75 28.5,102 31.5,99.75 32.25,97 34,98.75 25.75,92.75 30,94.5
  pour Top (isolate 0.25): 0,110.5 40,110.5 40,0 0,0
  pour Bottom (isolate 0.25): 0,110.5 40,110.5 40,0 0,0
N$2
  Bottom 0.25: L1.2 25.65,36.1 25.2,35.65 C25.A 24.7,33.75 23.25,35.2 C20.2 22.26,36.69 22.25,36.7 U3.1 20.2,36.7 20,36.5 20,34.95 20.15,34.8 U3.3
N$7
  Bottom 0.25: H3.2 H3.1 14.92,53.73 D2.C
N$8
  Bottom 0.25: R18.1 8.9,24.21 8.9,19.2 9.2,18.9 9.85,18.9 10.35,18.4 11.8,18.4 12.3,17.9 12.3,15.65 13.2,14.75 15.5,14.75 17.4,12.85 17.4,9.6 17.9,9.1 17.9,8.4 18.15,8.15 19.05,8.15 19.55,7.65 23.15,7.65 24.92,5.88 J11.P3
N$9
  Bottom 0.25: H3.10 H3.9 25.08,53.73 D1.A
N$10  (via drill 0.35)
  Top 0.25: v16.8,21.55 16.65,21.7 13.7,21.7 13,22.4 v12.25,22.4
  Bottom 0.25: R17.1 12.25,24.06 v12.25,22.4 | J8.P3 22.85,17 20.85,19 17.45,19 16.6,19.85 16.6,21.35 v16.8,21.55
N$11
  Bottom 0.25: R16.1 26,25.81 26,28.42 J5.P3
N$12  (via drill 0.35)
  Top 0.25: v27.85,25 28.45,25.6 28.45,26.2 26.25,28.4 26.25,40.67 J2.P3
  Bottom 0.25: R15.1 v27.85,25
N$13
  Bottom 0.25: R20.1 0.5,27.06 0.5,41.55 0.95,42 J1.P3
N$14  (via drill 0.35)
  Top 0.25: v27.75,25.9 27.2,25.35 24.3,25.35 v24.1,25.55
  Bottom 0.25: R10.1 30.31,25.9 | 30.31,25.9 R15.2 R22.1 C27.1 | v27.75,25.9 30.31,25.9 | U5.2 v24.1,25.55
N$15
  Bottom 0.25: Q1.1 4.4,24.05 4.26,24.19 R19.1 R20.2
N$16
  Bottom 0.25: R11.1 R16.2 26.81,24.12 | 26.81,24.12 R23.1 C28.1 | 26.81,24.12 24.7,24.12 24.4,23.82 24.4,23.32 24.02,22.95 U5.6
N$17
  Bottom 0.25: S1.1 20.81,69.75 | 20.81,69.75 S1.2 | R4.2 20.81,69.75
N$18
  Bottom 0.25: C29.1 R24.1 R17.2 | R17.2 R12.1 | U5.13 16.15,25.55 15.6,25 R17.2
N$19
  Bottom 0.25: U6.2 29.85,13.05 29.25,13.65 29.25,17.3 31.1,19.15 31.1,25.25 34.55,28.7 34.55,30.1 35.81,31.36 R9.2 R8.1 36.65,35.75 36.71,35.69 C22.2
N$20
  Bottom 0.25: R13.1 R18.2 R25.1 C30.1 12.4,20.41 12.4,19.2 12.7,18.9 15.3,18.9 15.6,19.2 15.6,22.6 15.95,22.95 U5.9
N$21
  Bottom 0.25: R28.1 0.9,22.91 0.9,24.7 1.2,25 2.3,25 2.6,25.3 2.6,29.48 J4.P3
N$22  (via drill 0.35)
  Top 0.25: v27.75,24.1 27,24.85 23.8,24.85 22.8,25.85 22,25.85 v21.8,26.05
  Bottom 0.25: R29.1 C27.2 R22.2 27.84,24.1 v27.75,24.1 | U5.1 21.95,26.2 v21.8,26.05
N$23
  Bottom 0.25: R30.1 C28.2 25.19,22.38 | 25.19,22.38 R23.2 | 25.19,22.38 24.3,22.38 24.23,22.3 U5.7
N$24
  Bottom 0.25: Q2.1 4.4,20.3 4.26,20.44 R27.1 R28.2
N$25
  Bottom 0.25: R31.1 C29.2 R24.2 14,24.06 14,27.3 14.3,27.6 15.3,27.6 15.6,27.3 15.6,26.6 16,26.2 U5.14
N$26
  Bottom 0.25: R25.2 C30.2 R32.1 10.54,18.9 12,18.9 12.5,18.4 15.5,18.4 16.1,19 16.1,22.1 16.3,22.3 U5.8
N$27
  Bottom 0.25: S4.1 20.81,54.75 | 20.81,54.75 S4.2 | R5.2 20.81,54.75
N$28
  Bottom 0.25: C26.2 36.66,23.19 36.6,23.25 R21.1 R26.2 35.81,18.76 34.55,17.5 34.55,16.2 32.15,13.8 32.15,11.1 31.5,10.45 U6.6
N$30
  Bottom 0.25: R36.1 1.75,14.45 2.58,15.28 J7.P3
N$31
  Bottom 0.25: Q3.1 4.4,11.55 4.26,11.69 R35.1 R36.2
N$32
  Bottom 0.25: C32.2 36.66,10.69 36.6,10.75 R37.1 R39.2 35.81,8.06 34.8,7.05 30.35,7.05 29.5,6.2 26,6.2 24.3,7.9 24.3,9.05 23.9,9.45 23.9,10.25 24.1,10.45 U6.9
N$34
  Bottom 0.25: R40.2 R38.1 21.1,10.75 21.16,10.69 C33.2 22.99,10.69 23.35,11.05 23.35,12.4 24,13.05 U6.13
N$35
  Bottom 0.25: R42.1 0.9,8.71 0.9,6.18 J10.P3
N$36
  Bottom 0.25: R42.2 R41.1 4.26,7.94 4.4,7.8 Q4.1
N$37
  Bottom 0.25: U6.1 29.95,13.7 29.75,13.9 29.75,17.1 31.6,18.95 31.6,25.05 34.75,28.2 36.4,28.2 37.15,28.95 37.15,30.05 36.3,30.9 36.3,33.15 38.35,35.2 38.35,36.46 C22.1 36.74,37.31 36.55,37.5 R7.1
N$38
  Bottom 0.25: R14.1 36.55,25 36.74,24.81 C26.1 38.35,23.96 38.35,22.7 38.05,22.4 37.05,22.4 36.6,21.95 36.6,20.9 36.3,20.6 36.3,18.4 37.15,17.55 37.15,16.45 36.4,15.7 34.75,15.7 32.65,13.6 32.65,10.9 31.55,9.8 U6.7
N$39
  Bottom 0.25: C32.1 36.74,12.31 36.55,12.5 R33.1 35,11.69 35,7.95 34.6,7.55 30.15,7.55 29.3,6.7 26.2,6.7 24.82,8.07 U6.8
N$40
  Bottom 0.25: R34.1 21,12.5 21.19,12.31 C33.1 22,13.3 22.4,13.7 U6.14
N$45
  Bottom 0.25: R8.2 R7.2 33.4,37.5 28.9,42 J3.P3
N$46  (via drill 0.35)
  Top 0.25: v35,25.85 33.55,27.3 v32.1,27.3
  Bottom 0.25: R21.2 R14.2 34.19,25.04 v35,25.85 | v32.1,27.3 31.15,27.3 30.85,27.6 29.48,27.6 J6.P3
N$47  (via drill 0.35)
  Top 0.25: v35,13.35 29.2,13.35 28.55,14 v28.55,14.3
  Bottom 0.25: R37.2 R33.2 34.19,12.54 v35,13.35 | J9.P3 28.75,15.83 28.75,14.5 v28.55,14.3
N$48
  Bottom 0.25: R34.2 R38.2 19.5,9.94 19.5,8.4 19.75,8.15 23.35,8.15 25.8,5.7 26.38,5.7 J12.P3
OFFSET
  Bottom 0.25: 13.19,27.6 10.54,27.6 R13.2 8.65,26.75 7.9,27.5 6.65,27.5 5.5,28.65 5.5,32.1 3.7,33.9 U4.2 3.7,35.1 3.56,35.24 C23.1 R6.2 | 13.19,27.6 13.6,27.6 14.1,28.1 15.5,28.1 16.85,26.75 23.65,26.75 | 23.65,26.75 R11.2 | R12.2 13.19,27.6 | 23.65,26.75 23.65,30.05 24.4,30.8 25.45,30.8 26.25,30 26.25,28.95 27,28.2 28.15,28.2 28.69,27.66 R10.2
RST
  Bottom 0.25: H1.9 23.58,101.98 22.54,100.94 A1.5
RST-DAC  (via drill 0.35)
  Top 0.25: v20,80.5 20,80.8 20.55,81.35 20.55,85.15 23.65,88.25 23.65,92.65 26,95 28.5,95 30.75,97.25 30.75,98.25 v31,98.5
  Bottom 0.25: H1.11 29.89,99.11 30.5,98.5 v31,98.5 | U1.13 18.82,80.58 18.95,80.7 19.8,80.7 v20,80.5
SCK  (via drill 0.35)
  Top 0.25: v19.25,80 19.25,80.75 20.05,81.55 20.05,85.35 23.15,88.45 23.15,93.15 v23.35,93.35
  Bottom 0.25: H2.14 37.51,90.54 32.55,95.5 29,95.5 27.25,93.75 23.75,93.75 v23.35,93.35 22.81,93.35 A1.3 | U1.10 18.12,78.62 19.25,79.75 v19.25,80
SW-B  (via drill 0.35)
  Top 0.25: v20,58.85 20,72.85 19.3,73.55 19.3,74.15 19.5,74.35 19.5,75.85 17.05,78.3 17.05,80.25 17.75,80.95 17.75,81.35 18.55,82.15 18.55,85.95 21.65,89.05 21.65,94.65 22.5,95.5 25,95.5 25.5,96 28,96 29.75,97.75 29.75,99.5 28.5,100.75 21,100.75 20.25,101.5 v17.5,101.5
  Bottom 0.25: R5.1 C12.1 19.19,58.04 v20,58.85 | H1.6 17.19,101.81 v17.5,101.5
SW-L  (via drill 0.35)
  Top 0.25: S2.E 8.8,72.7 8.8,82.55 v11.5,85.25
  Bottom 0.25: C9.2 9.18,72.32 S2.E | H2.4 12.11,85.86 v11.5,85.25
SW-R
  Bottom 0.25: S3.E 35,75.7 36.25,76.95 36.25,84.2 34.97,85.48 H2.13
SW-T  (via drill 0.35)
  Top 0.25: v20,73.85 20,76.1 17.55,78.55 17.55,80.05 18.25,80.75 18.25,81.15 19.05,81.95 19.05,85.75 22.15,88.85 22.15,94.4 22.75,95 25.25,95 25.75,95.5 28.25,95.5 30.25,97.5 30.25,99.75 28.75,101.25 21.65,101.25 v21.4,101.5
  Bottom 0.25: R4.1 C8.1 19.19,73.04 v20,73.85 | H1.7 20.92,101.98 v21.4,101.5
TR1  (via drill 0.35)
  Top 0.25: v7.6,26.1 7.3,26.1 5.5,27.9 5.5,53.3 2.9,55.9 2.9,59 6.2,62.3 6.2,68.8 7.8,70.4 7.8,72.6 3.4,77 3.4,89.7 7.2,93.5 v7.5,93.5
  Bottom 0.25: Q1.3 v7.6,26.1 | H1.2 7.03,93.97 v7.5,93.5
TR2  (via drill 0.35)
  Top 0.25: v7.6,22.35 7.4,22.55 7.4,25.3 5,27.7 5,53.1 2.4,55.7 2.4,59.2 5.7,62.5 5.7,69 7.3,70.6 7.3,72.4 2.9,76.8 2.9,89.9 8.25,95.25 v9.25,95.25
  Bottom 0.25: Q2.3 v7.6,22.35 | H1.3 9.57,95.57 v9.25,95.25
TR3  (via drill 0.35)
  Top 0.25: v7.6,13.6 7.3,13.6 5.5,15.4 5.5,17.85 6.9,19.25 6.9,25.1 4.5,27.5 4.5,52.9 1.9,55.5 1.9,59.4 5.2,62.7 5.2,69.2 6.8,70.8 6.8,72.2 2.4,76.6 2.4,90.1 10.05,97.75 10.05,99.8 v11.5,101.25
  Bottom 0.25: Q3.3 v7.6,13.6 | H1.4 12.11,101.86 v11.5,101.25
TR4  (via drill 0.35)
  Top 0.25: v7.6,9.85 7.6,12.6 5,15.2 5,18.05 6.4,19.45 6.4,24.9 4,27.3 4,52.7 1.4,55.3 1.4,59.6 4.7,62.9 4.7,69.4 6.3,71 6.3,72 1.9,76.4 1.9,90.3 9.55,97.95 9.55,100 10.8,101.25 10.8,101.55 11.2,101.95 11.8,101.95 12.4,101.35 v12.4,101.15
  Bottom 0.25: Q4.3 v7.6,9.85 | v12.4,101.15 14.65,101.15 H1.5
V-BIAS  (via drill 0.35)
  Top 0.25: v27.75,12.4 26.35,12.4 23.05,15.7 23.05,18.55 18.45,23.15 18.45,27.75 17.95,28.25 17.95,42.65 17.2,43.4 15.05,43.4 14.55,43.9 12.4,43.9 11.05,45.25 11.05,53.15 13.65,55.75 13.65,58.85 17.05,62.25 17.05,67.65 15.5,69.2 15.5,75.1 v15.7,75.3
  Bottom 0.25: U6.5 31.45,11.1 31.65,11.3 31.65,12.2 31.45,12.4 U6.3 v27.75,12.4 U6.12 24.05,12.4 23.85,12.2 23.85,11.3 24.05,11.1 U6.10 | R2.1 R3.2 C7.1 28.81,74.01 28.35,73.55 25.75,73.55 23.8,75.5 22.7,75.5 21.75,74.55 18.25,74.55 17.3,75.5 15.9,75.5 v15.7,75.3
VREF-2V5
  Bottom 0.25: R2.2 C4.1 | C2.1 C4.1 | C4.1 25.45,80.5 24.73,81.22 U1.3

### Text on the board
tPlace: Board derived from work by / Max Stadler (mxmxmx)
bPlace: 2020-02-22 | TD-OCSE-C-MB | USB / HERE | A2 | TEENSY 3.2 | SN | tall-dog.com | POWER | MAIN BOARD | µo_C SE